# EAGLE design BatteryPower (EAGLE 9.5.1)
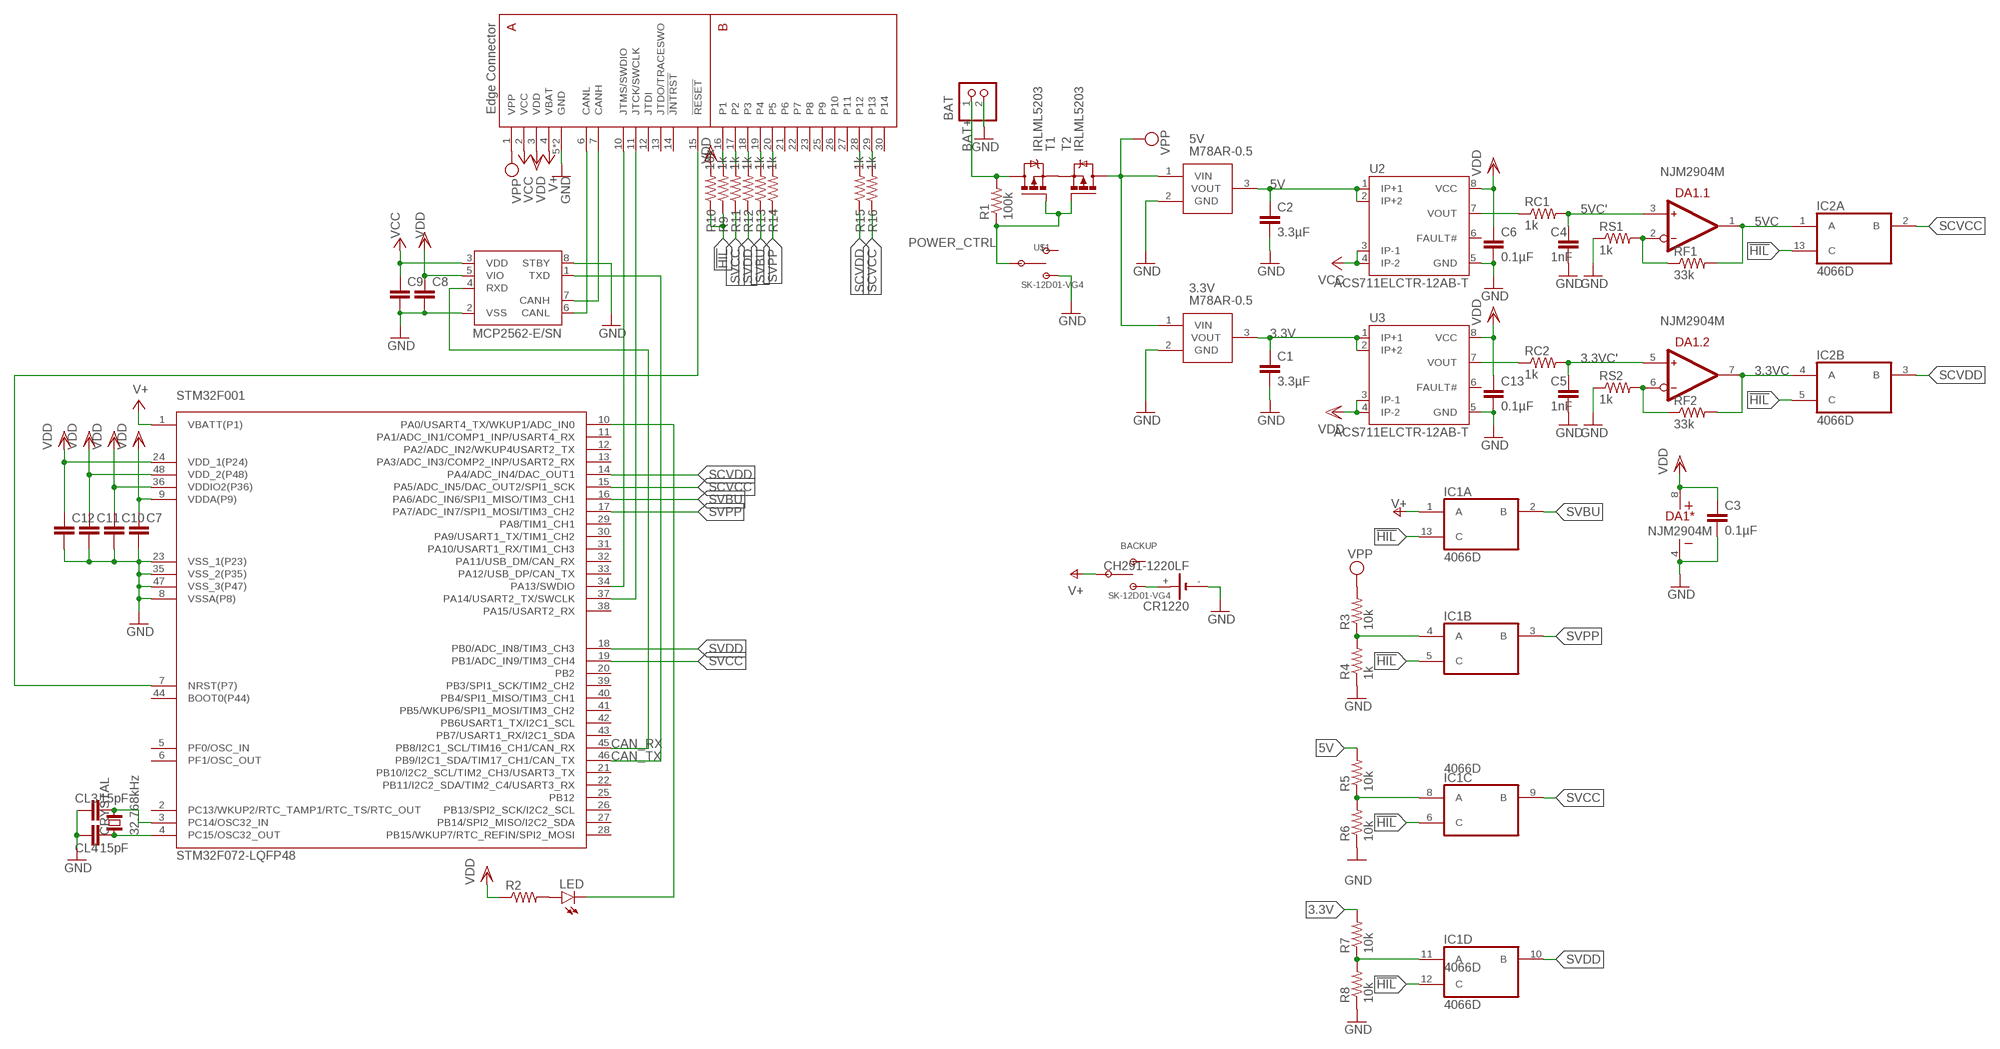
[diagram p0: schematic, sheet 1]

## Parts
3.3V  M78AR-0.5  [SHDR3W75P0X254_1X3_1128X755X10]
5V  M78AR-0.5  [SHDR3W75P0X254_1X3_1128X755X10]
BACKUP  SK-12D01-VG4  [SK-12D01-VG4]
BAT  S2B-XH-A  [S2B-XH-A]
C1  3.3µF  C-EUC0603K  [C0603K]
C2  3.3µF  C-EUC0603K  [C0603K]
C3  0.1µF  C-EUC0603K  [C0603K]
C4  1nF  C-EUC0603K  [C0603K]
C5  1nF  C-EUC0603K  [C0603K]
C6  0.1µF  C-EUC0603K  [C0603K]
C7  C-EUC0603K  [C0603K]
C8  C-EUC0603K  [C0603K]
C9  C-EUC0603K  [C0603K]
C10  C-EUC0603K  [C0603K]
C11  C-EUC0603K  [C0603K]
C12  C-EUC0603K  [C0603K]
C13  0.1µF  C-EUC0603K  [C0603K]
CL3  15pF  C-EUC0603K  [C0603K]
CL4  15pF  C-EUC0603K  [C0603K]
CR1220  CH291-1220LF  [CH291-1220LF]
CRYSTAL  32.768kHz  CRYTALFC-255  [FC-255]
DA1  NJM2904M  [SO-8]
IC1  4066D  [SO14]
IC2  4066D  [SO14]
LED  LEDCHIP-LED0603  [CHIP-LED0603]
MCP2562  MCP2562-E/SN  [SOIC127P600X175-8N]
R1  100k  R-US_R0603  [R0603]
R2  R-US_R0603  [R0603]
R3  10k  R-US_R0603  [R0603]
R4  1k  R-US_R0603  [R0603]
R5  10k  R-US_R0603  [R0603]
R6  10k  R-US_R0603  [R0603]
R7  10k  R-US_R0603  [R0603]
R8  10k  R-US_R0603  [R0603]
R9  1k  R-US_R0603  [R0603]
R10  10k  R-US_R0603  [R0603]
R11  1k  R-US_R0603  [R0603]
R12  1k  R-US_R0603  [R0603]
R13  1k  R-US_R0603  [R0603]
R14  1k  R-US_R0603  [R0603]
R15  1k  R-US_R0603  [R0603]
R16  1k  R-US_R0603  [R0603]
RC1  1k  R-US_R0603  [R0603]
RC2  1k  R-US_R0603  [R0603]
RF1  33k  R-US_R0603  [R0603]
RF2  33k  R-US_R0603  [R0603]
RS1  1k  R-US_R0603  [R0603]
RS2  1k  R-US_R0603  [R0603]
STM32F001  STM32F072-LQFP48  [LQFP48]
T1  IRLML5203  [MICRO3]
T2  IRLML5203  [MICRO3]
U2  ACS711ELCTR-12AB-T  [SOIC8]
U3  ACS711ELCTR-12AB-T  [SOIC8]
U$1  SK-12D01-VG4  [SK-12D01-VG4]
U$2  EDGE30  [EDGE30]

## Nets
3.3V: 3.3V.3(VOUT) C1.1 R7.2 U3.1(IP+1) U3.2(IP+2)
3.3VC: DA1.7(.2:OUT) IC2.4(B:A) RF2.2
3.3VC': C5.1 DA1.5(.2:IN+) RC2.2
5V: 5V.3(VOUT) C2.1 R5.2 U2.1(IP+1) U2.2(IP+2)
5VC: DA1.1(.1:OUT) IC2.1(A:A) RF1.2
5VC': C4.1 DA1.3(.1:IN+) RC1.2
!HIL!: IC1.5(B:C) IC1.6(C:C) IC1.12(D:C) IC1.13(A:C) IC2.5(B:C) IC2.13(A:C) R9.1 R10.1
BAT+: BAT.1 R1.2 T1.3(D)
BU+: BACKUP.B CR1220.+
CAN_RX: MCP2562.4(RXD) STM32F001.45(PB8/I2C1_SCL/TIM16_CH1/CAN_RX)
CAN_TX: MCP2562.1(TXD) STM32F001.46(PB9/I2C1_SDA/TIM17_CH1/CAN_TX)
CANH1: MCP2562.7(CANH) U$2.7(CANH)
CANL1: MCP2562.6(CANL) U$2.6(CANL)
GND: 3.3V.2(GND) 5V.2(GND) BAT.2 C1.2 C2.2 C3.2 C4.2 C5.2 C6.2 C7.2 C8.2 C9.2 C10.2 C11.2 C12.2 C13.2 CL3.1 CL4.1 CR1220.- DA1.4(*:V-) MCP2562.2(VSS) MCP2562.8(STBY) R4.1 R6.1 R8.1 RS1.1 RS2.1 STM32F001.8(VSSA(P8)) STM32F001.23(VSS_1(P23)) STM32F001.35(VSS_2(P35)) STM32F001.47(VSS_3(P47)) U2.5(GND) U3.5(GND) U$1.B U$2.5(GND) U$2.8(GND)
N$1: R9.2 U$2.16(P1)
N$2: T1.2(S) T2.2(S)
N$5: DA1.2(.1:IN-) RF1.1 RS1.2
N$6: DA1.6(.2:IN-) RF2.1 RS2.2
N$8: RC1.1 U2.7(VOUT)
N$9: RC2.1 U3.7(VOUT)
N$34: R16.2 U$2.29(P13)
N$35: R15.2 U$2.28(P12)
N$48: R14.2 U$2.20(P5)
N$49: R13.2 U$2.19(P4)
N$50: R12.2 U$2.18(P3)
N$71: CL4.2 CRYSTAL.1 STM32F001.4(PC15/OSC32_OUT)
N$72: CL3.2 CRYSTAL.2 STM32F001.3(PC14/OSC32_IN)
N$73: LED.C STM32F001.10(PA0/USART4_TX/WKUP1/ADC_IN0)
N$75: R11.2 U$2.17(P2)
N$76: LED.A R2.2
NRST1: STM32F001.7(NRST(P7)) U$2.15(!RESET!)
POWER_CTRL: R1.1 T1.1(G) T2.1(G) U$1.C
PVCC: IC1.8(C:A) R5.1 R6.2
PVDD: IC1.11(D:A) R7.1 R8.2
PVPP: IC1.4(B:A) R3.1 R4.2
SCVCC: IC2.2(A:B) R16.1 STM32F001.15(PA5/ADC_IN5/DAC_OUT2/SPI1_SCK)
SCVDD: IC2.3(B:B) R15.1 STM32F001.14(PA4/ADC_IN4/DAC_OUT1)
SVBU: IC1.2(A:B) R13.1 STM32F001.16(PA6/ADC_IN6/SPI1_MISO/TIM3_CH1)
SVCC: IC1.9(C:B) R11.1 STM32F001.19(PB1/ADC_IN9/TIM3_CH4)
SVDD: IC1.10(D:B) R12.1 STM32F001.18(PB0/ADC_IN8/TIM3_CH3)
SVPP: IC1.3(B:B) R14.1 STM32F001.17(PA7/ADC_IN7/SPI1_MOSI/TIM3_CH2)
SWCLK1: STM32F001.37(PA14/USART2_TX/SWCLK) U$2.11(JTCK/SWCLK)
SWDIO1: STM32F001.34(PA13/SWDIO) U$2.10(JTMS/SWDIO)
VBAT: BACKUP.C IC1.1(A:A) STM32F001.1(VBATT(P1)) U$2.4(VBAT) ; supply symbol labelled V+
VCC: C9.1 MCP2562.3(VDD) U2.3(IP-1) U2.4(IP-2) U$2.2(VCC)
VDD: C3.1 C6.1 C7.1 C8.1 C10.1 C11.1 C12.1 C13.1 DA1.8(*:V+) MCP2562.5(VIO) R2.1 R10.2 STM32F001.9(VDDA(P9)) STM32F001.24(VDD_1(P24)) STM32F001.36(VDDIO2(P36)) STM32F001.48(VDD_2(P48)) U2.8(VCC) U3.3(IP-1) U3.4(IP-2) U3.8(VCC) U$2.3(VDD)
VPP: 3.3V.1(VIN) 5V.1(VIN) R3.2 T2.3(D) U$2.1(VPP)
Unconnected: BACKUP.A IC2.6(C:C) IC2.8(C:A) IC2.9(C:B) IC2.10(D:B) IC2.11(D:A) IC2.12(D:C) STM32F001.2(PC13/WKUP2/RTC_TAMP1/RTC_TS/RTC_OUT) STM32F001.5(PF0/OSC_IN) STM32F001.6(PF1/OSC_OUT) STM32F001.11(PA1/ADC_IN1/COMP1_INP/USART4_RX) STM32F001.12(PA2/ADC_IN2/WKUP4USART2_TX) STM32F001.13(PA3/ADC_IN3/COMP2_INP/USART2_RX) STM32F001.20(PB2) STM32F001.21(PB10/I2C2_SCL/TIM2_CH3/USART3_TX) STM32F001.22(PB11/I2C2_SDA/TIM2_C4/USART3_RX) STM32F001.25(PB12) STM32F001.26(PB13/SPI2_SCK/I2C2_SCL) STM32F001.27(PB14/SPI2_MISO/I2C2_SDA) STM32F001.28(PB15/WKUP7/RTC_REFIN/SPI2_MOSI) STM32F001.29(PA8/TIM1_CH1) STM32F001.30(PA9/USART1_TX/TIM1_CH2) STM32F001.31(PA10/USART1_RX/TIM1_CH3) STM32F001.32(PA11/USB_DM/CAN_RX) STM32F001.33(PA12/USB_DP/CAN_TX) STM32F001.38(PA15/USART2_RX) STM32F001.39(PB3/SPI1_SCK/TIM2_CH2) STM32F001.40(PB4/SPI1_MISO/TIM3_CH1) STM32F001.41(PB5/WKUP6/SPI1_MOSI/TIM3_CH2) STM32F001.42(PB6USART1_TX/I2C1_SCL) STM32F001.43(PB7/USART1_RX/I2C1_SDA) STM32F001.44(BOOT0(P44)) U2.6(FAULT#) U3.6(FAULT#) U$1.A U$2.12(JTDI) U$2.13(JTDO/TRACESWO) U$2.14(!JNTRST!) U$2.21(P6) U$2.22(P7) U$2.23(P8) U$2.25(P9) U$2.26(P10) U$2.27(P11) U$2.30(P14)

## Power pins joined to a net without a drawn wire
GND: IC1.7(P:VSS) IC2.7(P:VSS)
VDD: IC1.14(P:VDD) IC2.14(P:VDD)

## Library data of the parts
3.3V 5V = M78AR-0.5:M78AR-0.5: Switching Regulator 0.5A, SIP Package Source: Datasheet <http://www.minmax.com.tw/upfiles/all_/all_quickfiles_caty01451992608.pdf>; DESCRIPTION: Switching Regulator 0.5A, SIP Package; HEIGHT: 10.7mm; MANUFACTURER_NAME: Minmax; MANUFACTURER_PART_NUMBER: M78AR-0.5
BACKUP U$1 = switches:SK-12D01-VG4
BAT = con-jst-xh:S2B-XH-A: Wire-to-Board 2.5mm pitch side mount connector Source: http://www.jst-mfg.com/product/pdf/jpn/XH.pdf http://www.jst-mfg.com/product/detail.php?series=277
C1-C13 CL3 CL4 = rcl:C-EU: CAPACITOR, European symbol; SPICEPREFIX: C
CR1220 = battery:CH291-1220LF: Battery Holder, SMT, 12mm multicomp PART NO. CH291-1220LF Source: Data sheet <http://www.farnell.com/datasheets/1505860.pdf>
CRYSTAL = crystal':CRYTAL: CRYSTAL
DA1 = ic-jrc:NJM2904; MOUSER: 513-NJM2904M
IC1 IC2 = 40xx:4066: Quad bilateral ANALOG SWITCH
LED = led:LED: LED OSRAM: - CHIPLED LG R971, LG N971, LY N971, LG Q971, LY Q971, LO R971, LY R971 LH N974, LH R974 LS Q976, LO Q976, LY Q976 LO Q996 - Hyper CHIPLED LW Q18S LB Q993, LB Q99A, LB R99A - SideLED LS A670, LO A670, LY A670, LG A670, LP A670 LB A673, LV A673, LT A673, LW A673 LH A674 LY A675 LS A676, LA A676, LO A676, LY A676, LW A676 LS A679, LY A679, LG A679 - Hyper Micro SIDELED® LS Y876, LA Y876, LO Y876, LY Y876 LT Y87S - SmartLED LW L88C, LW L88S LB L89C, LB L89S, LG L890 LS L89K, LO L89K, LY L89K LS L896, LA L896, LO L896, LY L896 - TOPLED LS T670, LO T670, LY T670, LG T670, LP T670 LSG T670, LSP T670, LSY T670, LOP T670, LYG T670 LG T671, LOG T671, LSG T671 LB T673, LV T673, LT T673, LW T673 LH T674 LS T676, LA T676, LO T676, LY T676, LB T676, LH T676, LSB T676, LW T676 LB T67C, LV T67C, LT T67C, LS T67K, LO T67K, LY T67K, LW E67C LS E67B, LA E67B, LO E67B, LY E67B, LB E67C, LV E67C, LT E67C LW T67C LS T679, LY T679, LG T679 LS T770, LO T770, LY T770, LG T770, LP T770 LB T773, LV T773, LT T773, LW T773 LH T774 LS E675, LA E675, LY E675, LS T675 LS T776, LA T776, LO T776, LY T776, LB T776 LHGB T686 LT T68C, LB T68C - Hyper Mini TOPLED® LB M676 - Mini TOPLED Santana® LG M470 LS M47K, LO M47K, LY M47K Source: http://www.osram.convergy.de LUXEON: - LUMILED® LXK2-PW12-R00, LXK2-PW12-S00, LXK2-PW14-U00, LXK2-PW14-V00 LXK2-PM12-R00, LXK2-PM12-S00, LXK2-PM14-U00 LXK2-PE12-Q00, LXK2-PE12-R00, LXK2-PE12-S00, LXK2-PE14-T00, LXK2-PE14-U00 LXK2-PB12-K00, LXK2-PB12-L00, LXK2-PB12-M00, LXK2-PB14-N00, LXK2-PB14-P00, LXK2-PB14-Q00 LXK2-PR12-L00, LXK2-PR12-M00, LXK2-PR14-Q00, LXK2-PR14-R00 LXK2-PD12-Q00, LXK2-PD12-R00, LXK2-PD12-S00 LXK2-PH12-R00, LXK2-PH12-S00 LXK2-PL12-P00, LXK2-PL12-Q00, LXK2-PL12-R00 Source: www.luxeon.com KINGBRIGHT: KA-3528ASYC Source: www.kingbright.com
MCP2562 = mcp2562-E_SN:MCP2562-E/SN: MCP2562 Series 5 V Surface Mount High-Speed CAN Transceiver - SOIC-8; AVAILABILITY: Unavailable; DESCRIPTION: Microchip MCP2562-E/SN, CAN Transceiver 1MBps 1-channel IEC 61000-4-2, 8-Pin SOIC; MF: Microchip; MP: MCP2562-E/SN; PACKAGE: SO-8 Microchip; PRICE: None
R1-R14 RC1 RC2 RF1 RF2 RS1 RS2 = rcl:R-US_: RESISTOR, American symbol; SPICEPREFIX: R
R15 R16 = resistor:R-US_: RESISTOR, American symbol
STM32F001 = stm32f0:STM32F072
T1 T2 = transistor-power:IRLML5203: HEXFET P-Channel Power MOSFET
U2 U3 = allegro:ACS711E: SENSOR CURRENT 3.3V 8-SOIC tested: YES (etherbotix); CURRENT: 12.5A
U$2 = bus:EDGE30

## Board
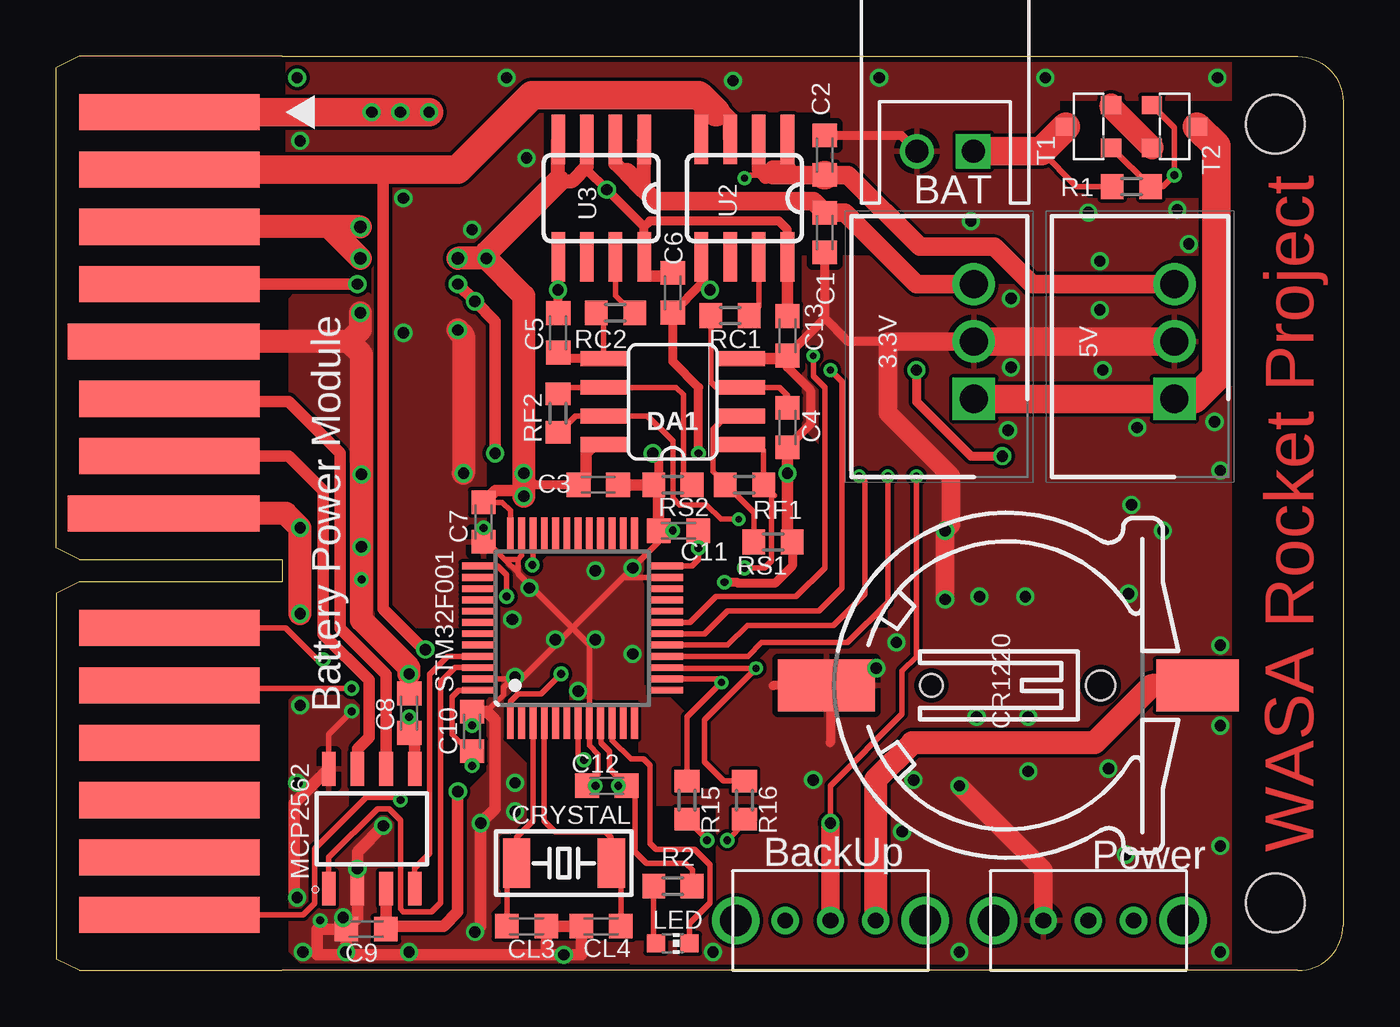
[diagram p1: board, top side]
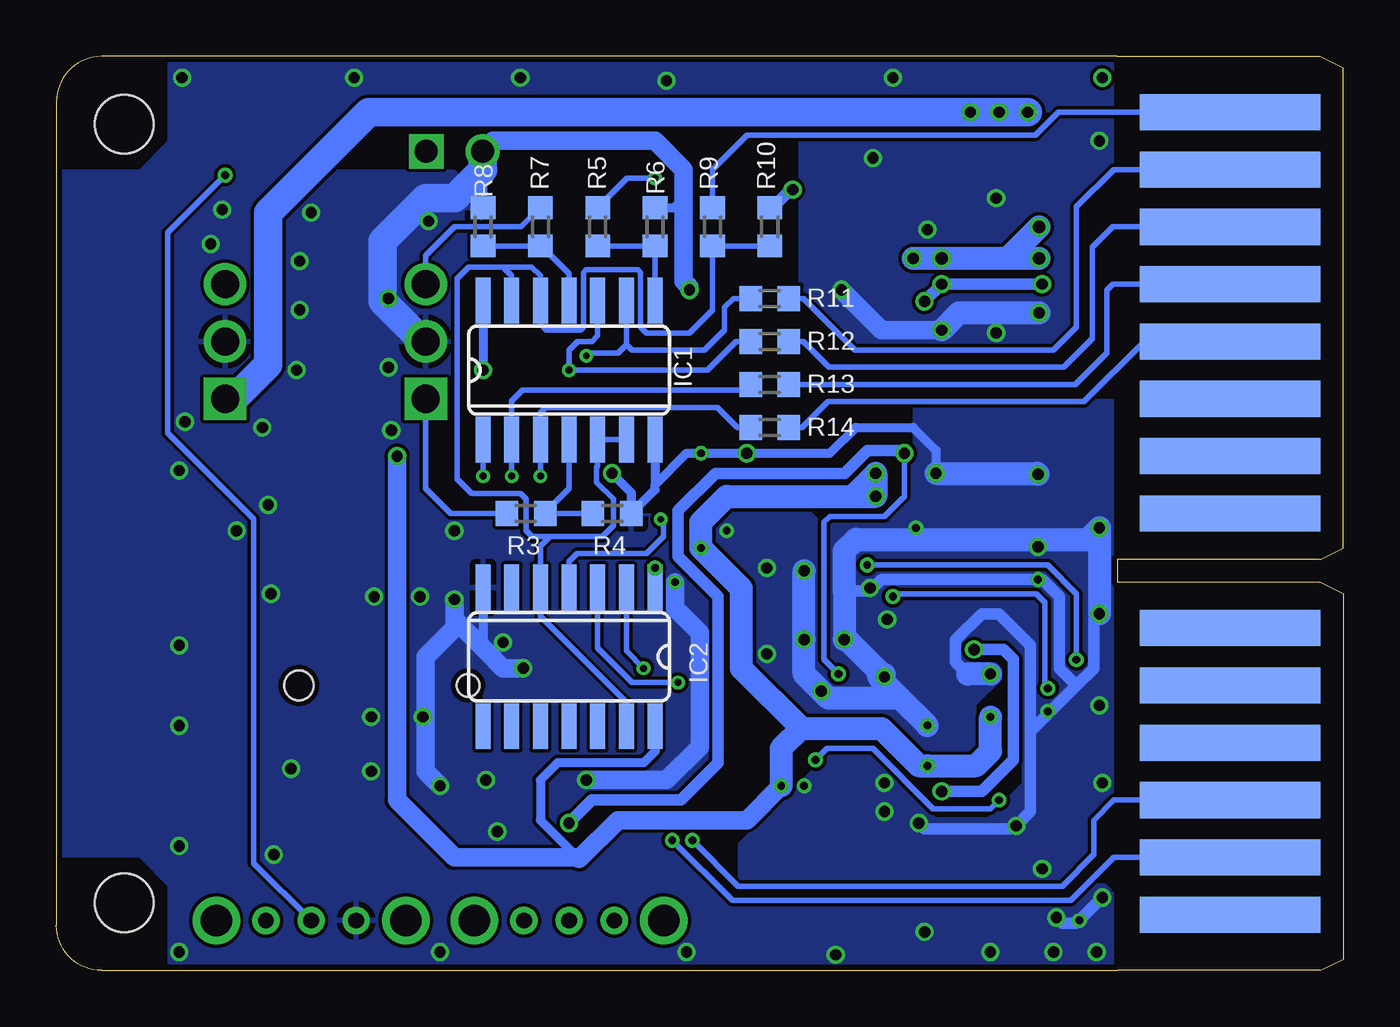
[diagram p2: board, bottom side, seen from below]

Size 57 x 40.5 mm. Coordinates in mm from the lower left corner, seen from the top.
Outline: 10,40.5 55,40.5 arc-90 57,38.5 57,2 arc-90 55,0 10,0
Copper layers (1*16): Top 0.035mm / dielectric 1.5mm / Bottom 0.035mm
Design rules "SeeedStudio_2layer_DRU_no_angle_20140221": minimum track width 6mil, minimum drill 12mil, track to track 6mil, track to pad 6mil, pad to pad 6mil, via to via 6mil, smd to smd 0mil, copper to edge 10mil, drill to drill 10mil, minimum pad ring 10mil, minimum via ring 6mil, stop-mask expansion 2mil, vias tented up to drill 100mil, thermal gap 10mil
Holes 2.6 mm at 54,3 54,37.5

### Footprints (pad centres in the part's own frame; a part is rotated, then mirrored left to right if it is on the bottom)
SHDR3W75P0X254_1X3_1128X755X10 = drill 1.25 pad 1.875 square: 1 0,0 | drill 1.25 pad 1.875: 2 2.54,0; 3 5.08,0
SK-12D01-VG4 = drill 1.4 pad 1.93: 1 -4.2,0; 2 4.2,0 | drill 0.7: A -2,0; B 2,0; C 0,0
S2B-XH-A = drill 1.016 square: 1 1.25,0 | drill 1.016: 2 -1.25,0
C0603K = smd 1.05 x 1.08: 1 -0.875,0; 2 0.875,0
CH291-1220LF = smd 2.3 x 3.66: + 0,-2.296 | smd 2.3 x 4.3: - 0,14.146 | hole 1.3: 0,2 | hole 1: 0,9.5
FC-255 = smd 1.2 x 2.2: 1 -2.1,0; 2 2.1,0
SO-8 = smd 0.66 x 2.032: 1 -1.905,-3.073; 2 -0.635,-3.073; 3 0.635,-3.073; 4 1.905,-3.073; 5 1.905,3.073; 6 0.635,3.073; 7 -0.635,3.073; 8 -1.905,3.073
SO14 = smd 0.66 x 2.032: 1 -3.81,-3.073; 2 -2.54,-3.073; 3 -1.27,-3.073; 4 0,-3.073; 5 1.27,-3.073; 6 2.54,-3.073; 7 3.81,-3.073; 8 3.81,3.073; 9 2.54,3.073; 10 1.27,3.073; 11 0,3.073; 12 -1.27,3.073; 13 -2.54,3.073; 14 -3.81,3.073
CHIP-LED0603 = smd 0.8 x 0.8: A 0,-0.75; C 0,0.75
SOIC127P600X175-8N = smd 1.5 x 0.6: 1 -2.65,1.905; 2 -2.65,0.635; 3 -2.65,-0.635; 4 -2.65,-1.905; 5 2.65,-1.905; 6 2.65,-0.635; 7 2.65,0.635; 8 2.65,1.905
R0603 = smd 1 x 1.1: 1 -0.85,0; 2 0.85,0
LQFP48 = smd 1.5 x 0.3: 1 -4.15,2.75; 2 -4.15,2.25; 3 -4.15,1.75; 4 -4.15,1.25; 5 -4.15,0.75; 6 -4.15,0.25; 7 -4.15,-0.25; 8 -4.15,-0.75; 9 -4.15,-1.25; 10 -4.15,-1.75; 11 -4.15,-2.25; 12 -4.15,-2.75; 25 4.15,-2.75; 26 4.15,-2.25; 27 4.15,-1.75; 28 4.15,-1.25; 29 4.15,-0.75; 30 4.15,-0.25; 31 4.15,0.25; 32 4.15,0.75; 33 4.15,1.25; 34 4.15,1.75; 35 4.15,2.25; 36 4.15,2.75 | smd 0.3 x 1.5: 13 -2.75,-4.15; 14 -2.25,-4.15; 15 -1.75,-4.15; 16 -1.25,-4.15; 17 -0.75,-4.15; 18 -0.25,-4.15; 19 0.25,-4.15; 20 0.75,-4.15; 21 1.25,-4.15; 22 1.75,-4.15; 23 2.25,-4.15; 24 2.75,-4.15; 37 2.75,4.15; 38 2.25,4.15; 39 1.75,4.15; 40 1.25,4.15; 41 0.75,4.15; 42 0.25,4.15; 43 -0.25,4.15; 44 -0.75,4.15; 45 -1.25,4.15; 46 -1.75,4.15; 47 -2.25,4.15; 48 -2.75,4.15
MICRO3 = smd 0.8 x 0.9: 1 -0.95,-1; 2 0.95,-1; 3 0,1
SOIC8 = smd 0.6 x 2.2: 1 -1.905,-2.6; 2 -0.635,-2.6; 3 0.635,-2.6; 4 1.905,-2.6; 5 1.905,2.6; 6 0.635,2.6; 7 -0.635,2.6; 8 -1.905,2.6
EDGE30 = smd 1.6 x 8: 1 -17.78,-5; 2 -15.24,-5; 3 -12.7,-5; 4 -10.16,-5; 6 -5.08,-5; 7 -2.54,-5; 10 5.08,-5; 11 7.62,-5; 12 10.16,-5; 13 12.7,-5; 14 15.24,-5; 15 17.78,-5 | smd 1.6 x 8.5: 5 -7.62,-5.25; 8 0,-5.25 | smd 1.6 x 8 bottom: 16 -17.78,-5; 17 -15.24,-5; 18 -12.7,-5; 19 -10.16,-5; 20 -7.62,-5; 21 -5.08,-5; 22 -2.54,-5; 23 0,-5; 25 5.08,-5; 26 7.62,-5; 27 10.16,-5; 28 12.7,-5; 29 15.24,-5; 30 17.78,-5

### Placement (x,y rotation side)
3.3V  40.64,25.33 90 top
5V  49.53,25.33 90 top
BACKUP  34.29,2.22 0 top
BAT  39.37,36.3 0 top
C1  34.04,32.7 270 top
C2  34.04,36.12 90 top
C3  24,21.52 0 top
C4  32.38,24.06 270 top
C5  22.23,28.25 90 top
C6  27.3,30.03 270 top
C7  18.92,19.87 270 top
C8  15.63,11.41 90 top
C9  13.72,1.84 180 top
C10  18.41,10.6 90 top
C11  27.56,19.49 180 top
C12  24.38,8.19 180 top
C13  32.38,28.12 270 top
CL3  20.83,1.96 180 top
CL4  24.13,1.96 0 top
CR1220  48.26,12.63 90 top
CRYSTAL  22.48,4.76 180 top
DA1  27.3,25.2 90 top
IC1  34.29,26.6 0 bottom
IC2  34.29,13.9 180 bottom
LED  27.3,1.2 270 top
MCP2562  13.97,6.28 90 top
R1  47.62,34.73 180 top
R2  27.3,3.74 180 top
R3  36.2,20.25 180 bottom
R4  32.38,20.25 180 bottom
R5  33.02,32.95 90 bottom
R6  30.48,32.95 270 bottom
R7  35.56,32.95 90 bottom
R8  38.1,32.95 270 bottom
R9  27.94,32.95 90 bottom
R10  25.4,32.95 90 bottom
R11  25.4,29.77 0 bottom
R12  25.4,27.87 0 bottom
R13  25.4,25.96 0 bottom
R14  25.4,24.06 0 bottom
R15  27.94,7.55 270 top
R16  30.48,7.55 270 top
RC1  29.84,29.01 180 top
RC2  24.77,29.14 180 top
RF1  30.48,21.52 0 top
RF2  22.23,24.7 270 top
RS1  31.75,18.98 180 top
RS2  27.3,21.52 0 top
STM32F001  22.86,15.17 90 top
T1  45.72,37.39 90 top
T2  49.53,37.39 270 top
U2  30.48,34.22 180 top
U3  24.13,34.22 180 top
U$1  45.72,2.22 180 top
U$2  10,20.25 270 top

### Tracks (layer width: path | path; a pad name or v marks a point on that pad's centre or on a via)
3.3V
  Top 0.61: 25.27,35.36 25.15,35.36 24.77,35.74 U3.2 | 26.04,34.6 U3.1
  Top 0.813: 3.3V.3 38.1,30.41 34.94,33.57 C1.1 33.53,34.08 26.56,34.08 26.04,34.6 25.27,35.36
  Bottom 0.254: R7.2 36.41,32.95 39.37,32.95 40.64,31.68 3.3V.3
3.3VC  (via drill 0.3)
  Top 0.254: RF2.2 22.27,23.84 23,24.57 DA1.7 26.19,24.57 27.3,23.45 27.3,20.93 27.6,20.63 28.8,20.63 29.43,20 v30.23,20
  Bottom 0.254: IC2.4 34.29,18.12 33.93,18.47 30.86,18.47 30.1,19.23 30.1,19.87 v30.23,20
3.3VC'
  Top 0.254: RC2.2 24.23,28.82 DA1.5
  Top 0.406: DA1.5 22.49,27.11 C5.1
5V  (via drill 0.3)
  Top 0.254: v30.48,35.11 30.61,35.24 31.75,35.24
  Top 0.61: U2.2 31.11,35.49 31.43,35.17 31.75,35.49 | 31.75,35.24 32,35.49 | 32.38,35.49 U2.1
  Top 0.813: 5V.3 43.2,30.41 41.54,32.07 38.24,32.07 35.07,35.25 C2.1 | 34.02,35.24 31.75,35.24 | 32.38,35.49 32,35.49 31.75,35.49
  Top 1.27: C2.1 34.02,35.24
  Bottom 0.254: R5.2 31.71,35.11 v30.48,35.11
5VC  (via drill 0.35)
  Top 0.254: DA1.1 31.06,23.3 31.33,23.03 RF1.2 | RF1.2 31.81,21.04 | RF1.2 31.68,21.17 31.68,18.15 31.37,17.84 v30.48,17.84
  Bottom 0.254: IC2.1 v30.48,17.84
5VC'
  Top 0.254: RC1.2 29,26.08 29.23,25.84 DA1.3 32.03,25.84 32.38,25.48 C4.1
!HIL!
  Bottom 0.254: IC2.13 31.75,11.87 35.56,15.68 IC2.5 35.56,18.8 35.14,19.23 | 33.02,22.84 IC1.5 | 35.14,19.23 32.81,19.23 32.33,19.71 32.33,20.88 33.07,21.62 33.07,22.31 33.02,22.36 IC1.5 | 31.75,22.79 IC1.6 IC1.5 | R10.1 R9.1 27.94,29.27 28.96,28.25 30.86,28.25 31.11,28.51 31.11,30.92 31.24,31.05 33.53,31.05 33.66,30.92 33.66,28.51 33.78,28.38 35.31,28.38 35.56,28.63 IC1.12 35.56,30.79 35.94,31.17 37.21,31.17 | 35.14,19.23 35.93,19.23 36.2,19.49 36.2,20.89 36.45,21.14 38.61,21.14 39.24,21.77 39.24,30.66 38.73,31.17 37.21,31.17 | IC1.13 36.83,30.79 37.21,31.17
BAT+
  Top 0.254: R1.2 45.2,34.73 43.62,36.3
  Top 1.27: T1.3 43.62,36.3 BAT.1
BU+
  Top 1.016: CR1220.+ 48.52,12.63 45.98,10.09 37.92,10.09 36.29,8.46 BACKUP.B
CAN_RX
  Top 0.254: STM32F001.45 17.33,13.92 16.54,13.13 16.54,5.18 15.88,4.52 MCP2562.4
CAN_TX
  Top 0.254: STM32F001.46 17.66,13.42 17.02,12.78 17.02,3 16.61,2.6 15.37,2.6 15.24,2.72 15.24,6.66 14.73,7.17 14.22,7.17 12.06,5.01 MCP2562.1
CANH1
  Top 0.508: MCP2562.7 13.34,9.82 13.84,10.33 13.84,12.87 11.81,14.9 11.81,21.27 10.29,22.79 U$2.7
CANL1
  Top 0.508: MCP2562.6 14.61,13.12 12.57,15.15 12.57,22.92 10.29,25.2 5.13,25.2 U$2.6
GND  (via drill 0.35, 0.5)
  Top 0.254: STM32F001.35 20.61,18.38 20.45,18.22 | 20.45,17.63 20.45,18.22 | STM32F001.47 20.19,12.92 | 20.19,12.92 20.61,12.92 22.86,15.17 | 22.86,15.17 20.45,17.58 20.45,17.63 | 22.86,15.17 23.61,14.42 STM32F001.8 23.61,9.97 24,9.58 24,8.68 C12.2 | STM32F001.23 25.11,17.42 | 22.86,15.17 25.11,17.42 | 19.16,11.47 19.06,11.47 19.81,12.22 19.81,12.54 20.19,12.92 | C7.2 19.18,18.74 19.34,18.74 19.86,18.22 | 20.45,18.22 19.86,18.22 | 19.86,18.22 20.45,17.63 | 25.11,17.42 v25.53,17.84 26.68,18.99 C11.2 | MCP2562.8 12.06,10.47 v13.08,11.49
  Top 0.406: C5.2 v22.23,30.16 U3.5 | 34.04,28.9 C13.2 32.38,26.73 33.4,25.71 33.4,24.2 C4.2 | 34.04,28.9 C1.2 | 34.04,28.9 35.07,27.87 36.83,27.87 | C2.2 37.42,37 BAT.2 | v26.42,22.92 26.68,22.65 26.68,21.29 | v28.45,22.92 28.45,25.84 27.3,26.98 C6.2 28.57,30.42 | U2.5 28.57,30.54 v28.96,30.16 | 31.75,12.63 CR1220.- 34.29,12.45 34.29,10.09 | RS1.1 32.6,17.93 31.83,17.15 30.2,17.15 30.15,17.2 v29.59,17.2
  Top 0.508: C9.2 13.34,2.33 MCP2562.2 v13.34,4.5 13.34,5.26 v14.48,6.41 | 12.84,0.95 13.1,0.69 v22.48,0.69 | C9.2 12.84,0.95 | v18.54,1.71 18.8,1.96 v18.8,6.53 19.43,7.17 19.43,11.11 19.06,11.47 C10.2 v18.41,10.85 | v15.62,13.14 v15.63,13.13 C8.2 | v18.92,19.61 C7.2 | v27.3,19.49 C11.2 26.68,21.29 RS2.1 C3.2 | v22.48,0.69 23.25,0.69 CL4.1 CL3.1 21.7,0.69 v22.48,0.69 | 23.25,0.71 23.24,0.69 | C9.2 11.56,1.84 11.56,0.69 12.59,0.69 12.84,0.95 | MCP2562.8 10.54,7.41 10.54,3.36 v10.67,3.23 | C13.2 32.24,27.11 DA1.4 | C4.2 v32.38,22.03 32.38,19.2 RS1.1
  Top 0.813: 3.3V.2 36.83,27.87 36.83,24.7 39.62,21.9 39.62,19.74 v39.37,19.49 v39.37,16.44 | CR1220.- 34.88,13.39 v36.32,13.39 | v40.01,8.19 43.72,4.47 U$1.B
  Top 1.016: U$2.8 10.16,20.25 v10.79,19.61 v10.79,15.8 | 12.95,27.87 U$2.5 | v15.62,13.14 15.62,13.42 13.51,15.53 v13.51,17.32 v13.51,18.77 v13.51,21.98 13.51,27.31 12.95,27.87 | v17.78,28.38 18.03,28.12 v18.03,22.03 | v13.46,29.14 13.46,28.38 12.95,27.87
  Top 1.27: 5V.2 3.3V.2
  Bottom 0.406: R8.1 38.1,36.28 BAT.2 | IC1.7 30.48,21.52 | 30.48,21.52 30.48,21.3 R4.1 31.54,21.18 v32.38,22.03 | 30.48,21.52 29.08,22.92 v28.45,22.92 v26.42,22.92 22.73,22.92 21.59,24.06 19.05,24.06 18.03,23.04 v18.03,22.03 | R6.1 29.63,33.8 29.21,34.22 | IC2.7 38.1,14.28 37.91,14.09
  Bottom 0.508: 16.64,13.14 17.17,13.67 17.17,14.64 16,15.8 15.24,15.8 13.84,14.41 13.84,10.6 | 13.84,10.6 13.84,7.04 v14.48,6.41 14.61,6.28 18.54,6.28 v18.8,6.53 | 13.84,10.6 11.81,12.63 | 11.81,12.63 11.05,13.39 11.05,15.55 v10.79,15.8 | 11.05,19.36 v10.79,19.61 | 22.1,16.82 20.95,16.82 20.46,17.32 v13.51,17.32 13.33,17.32 12.57,16.57 12.57,13.39 11.81,12.63 | v12.7,2.34 12.45,2.09 11.81,2.09 v11.68,2.22 v10.67,3.23
  Bottom 0.813: v17.78,28.38 20.45,28.38 v22.23,30.16 | v28.96,30.16 28.96,30.28 29.21,30.54 29.21,34.22 29.21,35.49 30.48,36.76 37.66,36.76 BAT.2 | v39.37,16.44 39.37,15.55 | 39.37,15.55 37.91,14.09 37.21,13.39 v36.32,13.39 | 39.37,15.55 39.37,15.17 40.64,13.9 40.64,8.82 v40.01,8.19 | v33.53,8.44 29.97,8.44 28.5,9.91 28.5,14.97 29.59,16.06 v29.59,17.2
  Bottom 1.016: v15.62,13.14 16.64,13.14 | 19.62,12.06 20.57,13.01 20.57,13.14 20.32,13.14 v20.32,13.01 21.97,14.66 v22.1,14.66 22.1,16.82 22.1,18.6 21.59,19.11 11.3,19.11 v10.79,19.61 v10.79,15.8 | 19.62,12.06 v18.41,10.85 | 19.62,12.06 22.8,12.06 v23.11,12.38 23.88,13.14 v23.88,14.66 v23.88,17.71 | v13.51,21.98 13.56,22.03 v18.03,22.03 | v17.78,28.38 17.02,29.14 v13.46,29.14
  Bottom 1.27: BAT.2 38.12,35.51 38.1,35.49 39.37,34.22 40.64,34.22 42.55,32.31 42.55,29.65 40.77,27.87 3.3V.2
  other vias: 23.88,8.19 20.32,8.31 20.32,7.04 10.92,0.82 12.83,0.82 20.95,16.95 20.19,15.55 25.53,14.03 15.62,0.82 10.67,8.31 10.79,11.74 29.08,0.82 40.01,0.82 51.56,0.82 51.56,5.52 47.37,5.14 51.56,10.85 51.56,14.41 43.05,8.82 46.61,8.95 37.97,8.44 37.47,6.15 37.21,14.54 42.29,29.77 46.23,29.27 46.35,26.6 42.29,26.73 42.16,23.93 47.88,24.06 51.31,24.31 51.56,22.16 47.62,20.63 49.02,19.49 47.5,16.69 42.93,16.57 40.89,16.57 40.77,11.23 43.05,11.23 40.51,33.2 45.72,33.59 49.66,33.71 46.23,31.43 50.16,32.19 15.37,34.22 15.37,28.25 18.41,32.82 20.83,36 10.79,36.76 19.94,39.55 29.97,39.43 36.45,39.55 43.81,39.55 51.44,39.55
  pour Top: 19.68,17.96 19.68,13.14 26.04,13.14 26.04,17.96
  pour Top: 19.68,13.14 19.68,12.12 20.32,12.12 20.32,12.38 21.97,12.38 21.97,13.14
  pour Top: 22.86,13.14 22.73,13.14 22.73,12.5 22.73,11.99 26.04,11.99 26.04,13.14
  pour Bottom: 23.24,17.33 23.24,20 24.26,21.01 27.81,21.01 29.46,19.36 29.46,13.01 26.92,10.47 19.68,10.47 18.92,9.71 16.51,9.71 16.26,9.96 16.26,20.25 22.23,20.25 22.73,19.74 22.73,13.9
  pour Bottom: 16.26,13.77 16.13,13.65 15.88,13.65 15.49,13.65 15.37,13.65 15.11,13.39 15.11,13.01 15.11,12.88 16.26,11.74
  pour Bottom: 20.76,20.82 17.65,23.93 14.22,23.93 10.16,19.87 10.16,13.39 12.95,10.6 14.48,10.6 14.61,10.72 14.61,14.03 15.11,14.54 16.26,14.54 16.26,16.31
  pour Bottom: 10.16,3.74 26.8,3.74 26.8,5.64 22.86,9.58 20.83,9.58 18.03,6.79 15.75,6.79 14.22,8.31 14.22,13.77 10.16,13.77
  pour Top (no thermals): 25.53,1.33 25.53,0.31 14.86,0.31 14.86,2.09 19.43,2.09 19.43,1.33
  pour Top (no thermals): 19.94,12.12 19.81,11.99 19.81,10.22 20.95,9.07 20.95,6.79 19.68,5.52 19.68,2.98 19.3,2.6 19.3,2.09 17.91,2.09 17.91,2.22 18.03,2.34 18.03,7.8 19.05,8.82 19.05,11.99 19.18,12.12
  pour Top (no thermals): 14.99,0.31 10.79,0.31 10.29,0.82 10.29,3.23 13.97,6.91 14.99,6.91
  pour Top (no thermals): 21.21,17.58 21.21,17.84 21.72,18.34 26.04,18.34 26.04,17.71 21.34,17.71
  pour Top (no thermals): 13.84,15.8 13.84,15.93 13.84,25.2
  pour Bottom: 10.16,-0.96 10.16,3.49 26.8,3.49 26.8,-0.96
  pour Bottom: 13.84,0.31 10.79,0.31 10.41,0.69 10.41,1.07 10.67,1.33 13.84,1.33
  pour Bottom: 11.68,1.84 13.08,1.84 13.34,2.09 13.34,2.22 13.34,2.6 13.08,2.85 12.7,2.85 11.94,2.85 10.92,3.87 10.54,3.87 10.29,3.61 10.29,2.85 11.18,1.96 11.3,1.84
  pour Top: 10.41,2.72 10.79,2.72 11.18,3.11 11.18,5.52 12.95,7.3 12.95,9.96 13.59,10.6 13.59,11.61 12.95,12.25 10.54,12.25 10.29,11.99 10.29,2.85
  pour Top: 13.08,15.55 13.08,22.41 10.29,25.2 10.29,29.77 10.54,30.03 13.84,30.03 14.1,29.77 14.1,15.17 13.46,15.17
  pour Top: 52.07,-0.07 52.07,24.06 36.83,24.06 36.83,-0.07
  pour Top: 38.1,-0.07 25.4,-0.07 25.4,1.33 27.69,1.33 29.21,2.85 29.21,7.3 25.78,7.3 25.78,12.63 26.67,12.63 27.94,11.36 27.94,8.06 30.1,8.06 28.96,9.2 28.96,11.61 32.51,15.17 38.1,15.17
  pour Top: 36.83,22.16 34.92,22.16 33.02,24.06 33.02,29.14 33.02,31.68 36.83,31.68 38.1,30.41 52.07,30.41 52.07,24.06 38.1,24.06 36.83,24.06
  pour Top: 19.05,15.17 15.24,15.17 13.97,16.44 13.97,18.98 13.97,35.49 15.24,36.76 21.59,36.76 21.59,32.95 20.32,31.68 17.78,31.68 19.05,30.41
  pour Bottom: 25.4,-0.07 52.07,-0.07 52.07,3.74 53.34,5.01 57.15,5.01 57.15,35.49 53.34,35.49 52.07,36.76 50.8,35.49 39.37,35.49 38.1,34.22 38.1,5.01 33.02,5.01 31.75,6.28 29.21,6.28 25.4,2.47
  pour Bottom: 38.1,5.01 35.56,5.01 33.02,7.55 29.21,7.55 27.94,8.82 27.94,18.98 29.21,20.25 38.1,20.25
  pour Top: 44.45,40.57 44.45,35.49 45.72,34.22 50.8,34.22 50.8,31.68 49.53,31.68 48.26,30.41 43.18,30.41 41.91,31.68 38.1,31.68 34.29,35.49 34.29,38.03 30.48,38.03 30.48,40.57
  pour Bottom: 10.16,18.98 10.16,25.33 19.05,25.33 19.05,18.98
  pour Bottom: 21.59,26.6 13.97,26.6 10.16,30.41 10.16,38.03 24.13,38.03 24.13,29.14
  pour Bottom: 52.07,32.95 52.07,40.57 10.16,40.57 10.16,38.03 43.18,38.03 48.26,32.95
  pour Top: 10.16,35.49 21.59,35.49 21.59,38.03 30.48,38.03 30.48,40.57 10.16,40.57
  pour Top: 43.18,40.57 52.07,40.57 52.07,38.54 43.18,38.54
N$1
  Bottom 0.254: R9.2 27.94,35.49 26.42,37.01 13.64,37.01 12.62,38.03 U$2.16
N$2
  Top 1.016: T2.2 46.72,38.27 T1.2
N$4  (via drill 0.5)
  other vias: 10.67,39.55
N$5
  Top 0.254: DA1.2 29.69,24.57 29.08,23.96 29.08,22.12 29.63,21.57 RF1.1 29.68,21.52 30.9,20.3 RS1.2
N$6
  Top 0.254: RF2.1 22.52,25.84 DA1.6 27.46,25.84 27.77,25.52 27.77,21.9 RS2.2
N$8
  Top 0.254: U2.7 31.11,29.43 RC1.1
N$9
  Top 0.254: RC2.1 25.54,29.14 24.77,29.91 U3.7
N$34  (via drill 0.35)
  Top 0.254: R16.2 30.48,6.53 v29.72,5.77
  Bottom 0.254: U$2.29 10.16,5.01 12.06,3.11 25.4,3.11 27.05,3.11 v29.72,5.77
N$35  (via drill 0.35)
  Top 0.254: R15.2 28.83,5.81 v28.83,5.77
  Bottom 0.254: U$2.28 10.16,7.55 11.05,6.66 11.05,5.14 12.45,3.74 25.4,3.74 26.8,3.74 v28.83,5.77
N$48
  Bottom 0.254: U$2.20 8.81,27.87 11.48,25.2 22.82,25.2 23.96,24.06 R14.2
N$49
  Bottom 0.254: U$2.19 10.21,30.41 10.46,30.16 10.46,27.36 11.86,25.96 R13.2
N$50
  Bottom 0.254: U$2.18 10.21,32.95 11.1,32.06 11.1,28 12.37,26.73 22.77,26.73 23.91,27.87 R12.2
N$71
  Top 0.254: STM32F001.4 21.61,6.64 22.1,6.15 24.32,6.15 24.58,5.9 CRYSTAL.1 25,4.33 CL4.2
N$72
  Top 0.254: STM32F001.3 21.11,6.63 20.38,5.9 CRYSTAL.2 19.95,4.33 CL3.2
N$73
  Top 0.254: STM32F001.10 24.61,10.21 25.45,9.37 26.01,9.37 26.29,9.09 26.29,5.64 26.56,5.37 28.26,5.37 28.96,4.68 28.96,2.99 28.05,2.09 LED.C
N$75
  Bottom 0.254: U$2.17 10.16,35.49 11.81,33.84 11.81,28.51 12.83,27.49 21.63,27.49 23.91,29.77 R11.2
N$76
  Top 0.254: R2.2 26.45,1.3 LED.A
NRST1  (via drill 0.35)
  Top 0.254: v23.37,9.33 23.11,9.59 STM32F001.7 | U$2.15 10.92,2.47 11.43,2.98 11.43,5.39 13.72,7.68 15.11,7.68 v15.24,7.55
  Bottom 0.254: v23.37,9.33 22.86,9.84 20.83,9.84 18.16,7.17 15.62,7.17 v15.24,7.55
POWER_CTRL  (via drill 0.35)
  Top 0.254: T1.1 46.76,36.45 R1.1 49.02,34.73 v49.53,35.24 49.53,37.34 T2.1
  Bottom 0.254: v49.53,35.24 52.07,32.7 52.07,23.81 48.26,20 48.26,4.76 U$1.C
PVCC
  Bottom 0.254: R5.1 R6.2 IC1.8
PVDD
  Bottom 0.254: R8.2 R7.1 35.51,32.1 34.29,30.88 IC1.11
PVPP
  Bottom 0.254: R4.2 R3.1 35.34,20.3 34.29,21.36 IC1.4
SCVCC  (via drill 0.3)
  Top 0.254: STM32F001.15 27.04,13.39 v30.99,13.39 28.7,11.11 28.7,9.24 29.54,8.4 R16.1
  Bottom 0.254: v30.99,13.39 31.75,14.15 IC2.2
SCVDD  (via drill 0.3)
  Top 0.254: STM32F001.14 29.3,12.92 v29.46,12.76 27.94,11.23 R15.1
  Bottom 0.254: IC2.3 33.02,14.28 31.5,12.76 v29.46,12.76
SVBU  (via drill 0.3)
  Top 0.254: v36.83,21.9 36.83,16.31 35.05,14.54 31.24,14.54 30.63,13.92 STM32F001.16
  Bottom 0.254: v36.83,21.9 IC1.2 36.83,25.23 36.35,25.71 26.5,25.71 R13.1
SVCC  (via drill 0.3)
  Top 0.254: v33.53,27.23 33.53,26.35 34.04,25.84 34.04,17.84 32.77,16.57 29.21,16.57 28.06,15.42 STM32F001.19
  Bottom 0.254: IC1.9 31.75,27.74 | 31.75,27.74 32.13,27.36 33.4,27.36 v33.53,27.23 | 31.75,27.74 31.5,27.49 28.28,27.49 27.39,28.38 27.39,29.39 27.01,29.77 R11.1
SVDD  (via drill 0.3)
  Top 0.254: v34.29,26.6 34.8,26.09 34.8,16.95 33.78,15.93 29.72,15.93 28.71,14.92 STM32F001.18
  Bottom 0.254: IC1.10 33.02,28.12 33.27,27.87 33.91,27.87 34.29,27.49 v34.29,26.6 28.16,26.6 26.89,27.87 R12.1
SVPP  (via drill 0.3)
  Top 0.254: v35.56,21.9 35.81,21.65 35.81,16.69 34.42,15.3 30.61,15.3 29.73,14.42 STM32F001.17
  Bottom 0.254: v35.56,21.9 IC1.3 35.56,24.72 35.33,24.95 27.72,24.95 26.84,24.06 R14.1
SWCLK1  (via drill 0.35)
  Top 0.254: v13.08,12.5 5.13,12.5 U$2.11 | v19.94,16.57 19.94,17.52 19.54,17.92 STM32F001.37
  Bottom 0.254: v19.94,16.57 19.81,16.69 13.59,16.69 13.21,16.31 13.21,12.63 v13.08,12.5
SWDIO1  (via drill 0.35)
  Top 0.254: v11.81,13.77 11.56,13.77 10.16,15.17 U$2.10 | STM32F001.34 21.11,17.99 v21.08,17.96
  Bottom 0.254: v11.81,13.77 11.81,16.69 13.08,17.96 v21.08,17.96
VBAT  (via drill 0.3, 0.35, 0.5)
  Top 0.254: STM32F001.1 20.11,11.91 20.45,12.25 21.46,12.25 v22.35,13.14 | v38.1,21.9 38.1,13.9 37.47,13.27 37.47,11.36 34.29,8.19 v34.29,6.53
  Top 0.508: U$2.4 v13.34,30.41 | v17.78,30.41 v18.54,29.65 19.43,28.76 v19.43,22.92
  Top 0.813: v34.29,6.53 BACKUP.C
  Bottom 0.254: v22.35,13.14 22.99,13.77 22.99,19.87 22.73,20.12 20.32,20.12 19.43,21.01 v19.43,22.92 | IC1.1 v38.1,21.9
  Bottom 0.508: v13.34,30.41 v17.78,30.41 v18.54,29.65 | v19.43,22.92 19.56,23.04 21.08,23.04 22.1,22.03 27.81,22.03 29.46,20.38 29.46,18.34 27.69,16.57 27.69,9.2 29.34,7.55 33.27,7.55 v34.29,6.53
VCC  (via drill 0.5)
  Top 0.508: MCP2562.3 14.61,1.85 C9.1 14.72,1.96 17.14,1.96 17.78,2.6 v17.78,7.93 | v16.35,14.22 16.26,14.22 14.47,16.01 14.47,32.95 14.48,32.96 14.48,35.49
  Top 0.61: U2.3 29.84,37.78 29.59,38.03 29.21,38.03 | U2.4 28.57,38.66
  Top 1.27: U$2.2 14.48,35.49 17.78,35.49 21.08,38.79 28.45,38.79 28.57,38.66 29.21,38.03
  Bottom 0.508: v17.78,7.93 16,7.93 14.61,9.33 14.61,13.77 15.05,14.22 v16.35,14.22
VDD  (via drill 0.35, 0.5, 0.55)
  Top 0.254: STM32F001.36 20.11,20.38 19.74,20.74 C7.1 | STM32F001.9 24.13,11 24.13,10.09 24.51,9.71 24.51,8.93 C12.1 25.64,7.8 25.64,5.26 26.15,4.76 27.88,4.76 28.18,4.45 28.18,3.72 R2.1 | STM32F001.48 17.82,12.42 17.53,12.12 17.53,10.47 18.27,9.72 C10.1 | STM32F001.24 28.15,17.92 28.43,18.2 C11.1
  Top 0.406: U3.8 26.04,32.95 | 23.5,35.62 23.5,35.49 v24.38,34.6 26.04,32.95 | v41.91,22.79 40.51,22.79 38.1,25.2 v38.1,26.6 | U2.8 32.38,32.82 32,33.2 26.29,33.2 26.04,32.95 | C3.1 21.21,21.52 v20.7,22.03
  Top 0.508: v18.41,9.07 C10.1 | C12.1 v24.89,8.19 | v15.62,11.23 v15.63,11.23 C8.1 15.88,10.28 MCP2562.5 | C7.1 19.45,21.27 20.45,21.27 v20.7,21.01 | v28.45,18.73 28.45,19.47 C11.1 | C3.1 23.13,21.54 23.47,21.88 23.47,22.92 23.85,23.3 DA1.8 | U2.8 C13.1 | U3.8 | U3.8 26.04,30.78 27.18,30.78 C6.1 | C6.1
  Top 0.61: U3.3 23.5,35.62 22.86,34.98 22.23,34.98 U3.4
  Top 0.813: v19.05,31.55 19.05,31.81
  Top 1.016: v20.7,21.01 v20.7,22.03 20.7,29.9 v19.05,31.55 v17.78,31.55 | v13.46,32.95 12.06,32.95 | 12.06,32.95 U$2.3 | v13.46,31.55 12.06,32.95 | 22.23,34.98 19.05,31.81
  Bottom 0.406: IC2.14 30.48,9.71 30.99,9.2 34.8,9.2 35.56,8.44 35.56,6.66 33.91,5.01 33.85,4.95 | IC1.14 v38.1,26.6
  Bottom 0.508: R10.2 25.27,33.8 24.47,34.6 v24.38,34.6
  Bottom 0.813: v24.89,8.19 26.42,6.66 32.13,6.66 33.85,4.95 | v41.91,22.79 41.91,7.55 39.37,5.01 33.91,5.01
  Bottom 1.016: v24.89,8.19 24.89,9.84 24,10.72 | 24,10.72 20.45,10.72 18.8,9.07 v18.41,9.07 16.26,9.07 15.62,9.71 v15.62,11.23 | 21.59,21.01 27.3,21.01 28.45,19.87 v28.45,18.73 26.67,16.95 26.67,13.39 24,10.72 | 21.59,21.01 v20.7,21.01 v20.7,22.03 21.59,21.14 21.59,21.01 | v19.05,31.55 v17.78,31.55 14.86,31.55 | 14.86,31.55 v13.46,31.55 | v13.46,32.95 14.86,31.55
VPP  (via drill 0.5)
  Top 1.27: T2.3 51.38,36.54 51.38,26.29 50.42,25.33 5V.1 3.3V.1 | U$2.1 v13.97,38.03 v15.24,38.03 v16.51,38.03
  Bottom 0.254: 3.3V.1 40.64,21.36 39.53,20.25 R3.2
  Bottom 1.27: v13.97,38.03 v15.24,38.03 v16.51,38.03 43.18,38.03 47.62,33.59 47.62,26.85 49.15,25.33 5V.1

### Text on the board
Top: WASA Rocket Project
tNames: Battery Power Module | BackUp | Power
tStop: WASA Rocket Project
bStop: Designed by @fujiy0, 2019